# Altium schematic sheet [05]USB_HUB.SchDoc
size B
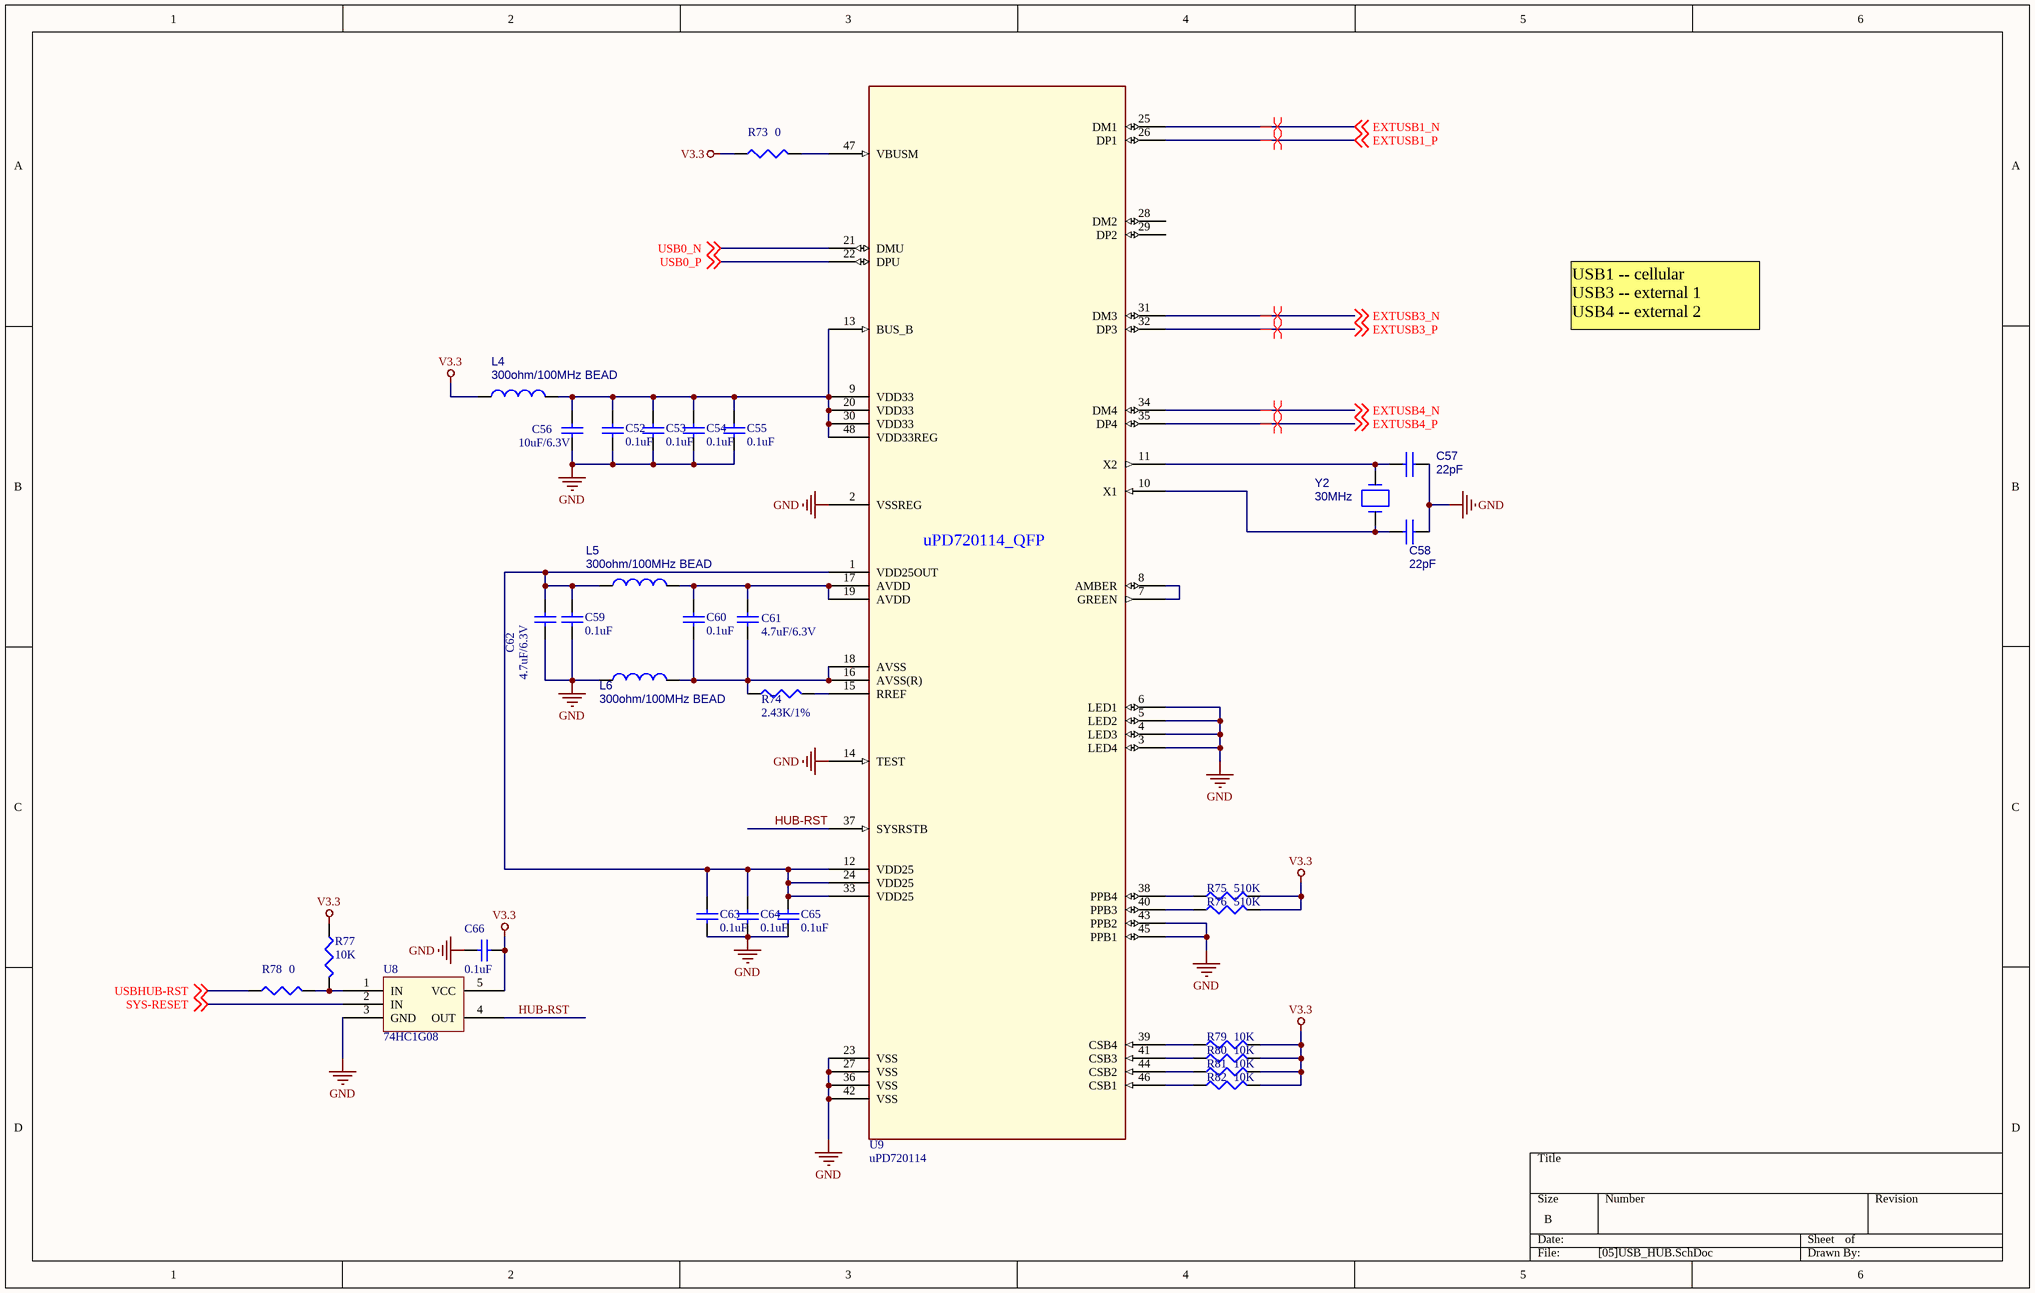
[diagram p0: [05]USB_HUB.SchDoc]

## Parts
C52  0.1uF  [0603]
C53  0.1uF  [0603]
C54  0.1uF  [0603]
C55  0.1uF  [0603]
C56  10uF/6.3V  [0805]
C57  22pF  [0603]
C58  22pF  [0603]
C59  0.1uF  [0603]
C60  0.1uF  [0603]
C61  4.7uF/6.3V  [0603]
C62  4.7uF/6.3V  [0603]
C63  0.1uF  [0603]
C64  0.1uF  [0603]
C65  0.1uF  [0603]
C66  0.1uF  [0603]
L4  300ohm/100MHz BEAD  [0603]
L5  300ohm/100MHz BEAD  [0603]
L6  300ohm/100MHz BEAD  [0603]
R73  0  [0603]
R74  2.43K/1%  [0603]
R75  510K  [0603]
R76  510K  [0603]
R77  10K  [0603]
R78  0  [0603]
R79  10K  [0603]
R80  10K  [0603]
R81  10K  [0603]
R82  10K  [0603]
U8  74HC1G08  [SOT23-5]
U9  uPD720114  [LQFP48]
Y2  30MHz  [SMD-XTAL-5032]

## Nets
GND: C52.1 C53.1 C54.1 C55.1 C56.1 C57.1 C58.1 C59.1 C62.1 C63.1 C64.1 C65.1 C66.2 L6.2 U8.3(GND) U9.2(VSSREG) U9.3(LED4) U9.4(LED3) U9.5(LED2) U9.6(LED1) U9.14(TEST) U9.23(VSS) U9.27(VSS) U9.36(VSS) U9.42(VSS) U9.43(PPB2) U9.45(PPB1)
V3.3: C66.1 L4.2 R73.1 R75.2 R76.2 R77.1 R79.2 R80.2 R81.2 R82.2 U8.5(VCC)
EXTUSB1_N: U9.25(DM1) ; off-sheet EXTUSB1_N
EXTUSB1_P: U9.26(DP1) ; off-sheet EXTUSB1_P
EXTUSB3_N: U9.31(DM3) ; off-sheet EXTUSB3_N
EXTUSB3_P: U9.32(DP3) ; off-sheet EXTUSB3_P
EXTUSB4_N: U9.34(DM4) ; off-sheet EXTUSB4_N
EXTUSB4_P: U9.35(DP4) ; off-sheet EXTUSB4_P
HUB-RST: U8.4(OUT) U9.37(SYSRSTB)
SYS-RESET: U8.2(IN) ; off-sheet SYS-RESET
USB0_N: U9.21(DMU) ; off-sheet USB0_N
USB0_P: U9.22(DPU) ; off-sheet USB0_P
USBHUB-RST: R78.1 ; off-sheet USBHUB-RST
NetC52_2: C52.2 C53.2 C54.2 C55.2 C56.2 L4.1 U9.9(VDD33) U9.13(BUS_B) U9.20(VDD33) U9.30(VDD33) U9.48(VDD33REG)
NetC57_2: C57.2 U9.11(X2) Y2.2
NetC58_2: C58.2 U9.10(X1) Y2.1
NetC59_2: C59.2 C62.2 C63.2 C64.2 C65.2 L5.2 U9.1(VDD25OUT) U9.12(VDD25) U9.24(VDD25) U9.33(VDD25)
NetC60_1: C60.1 C61.1 L6.1 R74.1 U9.16(AVSS(R)) U9.18(AVSS)
NetC60_2: C60.2 C61.2 L5.1 U9.17(AVDD) U9.19(AVDD)
NetR73_2: R73.2 U9.47(VBUSM)
NetR74_2: R74.2 U9.15(RREF)
NetR75_1: R75.1 U9.38(PPB4)
NetR76_1: R76.1 U9.40(PPB3)
NetR77_2: R77.2 R78.2 U8.1(IN)
NetR79_1: R79.1 U9.39(CSB4)
NetR80_1: R80.1 U9.41(CSB3)
NetR81_1: R81.1 U9.44(CSB2)
NetR82_1: R82.1 U9.46(CSB1)
NetU9_7: U9.7(GREEN) U9.8(AMBER)

Not connected (* = marked no-connect by the designer): U9 28(DM2) 29(DP2)

## Layout directives
differential pair: EXTUSB1_N, EXTUSB1_P, EXTUSB3_N, EXTUSB3_P, EXTUSB4_N, EXTUSB4_P

## Notes on the sheet
- USB1 -- cellular
  USB3 -- external 1
  USB4 -- external 2
- (in symbol upd720114_QFP_4) uPD720114_QFP

## Library data of the parts
C52-C56 C59-C66 = Cap: Capacitor
C57 C58 = CAP_Dup1
L4-L6 = INDUCTOR_4
R73-R82 = Res3: Resistor
U9 = upd720114_QFP_4
Y2 = CRYSTAL